# Altium schematic sheet BMP581.SchDoc
size A4; SheetNumber: 11; SheetTotal: 17
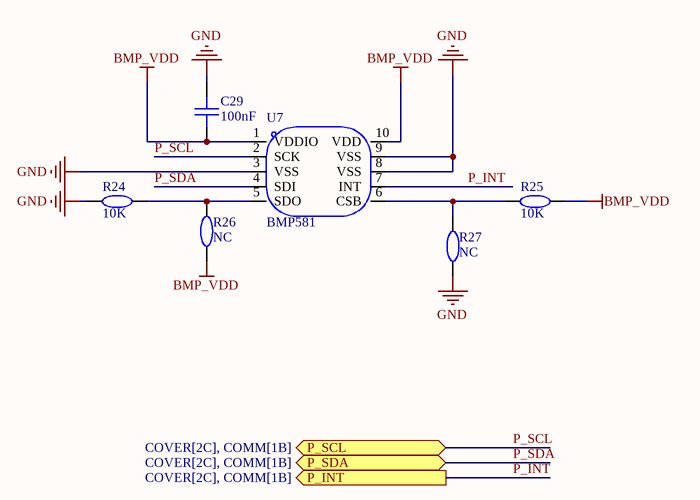
[diagram p0: BMP581.SchDoc]

## Parts
C29  100nF  [C0402]
R24  10K  [R0402]
R25  10K  [R0402]
R26  NC  [R0402]
R27  NC  [R0402]
U7  BMP581  [LGA-10_L2.0-W2.0-P0.50-TL_BMP581]

## Ports
P_INT (out, see COVER[2C], COMM[1B]), P_SCL (bidir, see COVER[2C], COMM[1B]), P_SDA (bidir, see COVER[2C], COMM[1B])

## Nets
BMP_VDD: C29.1 R25.2 R26.1 U7.1(VDDIO) U7.10(VDD)
GND: C29.2 R24.1 R27.1 U7.3(VSS) U7.8(VSS) U7.9(VSS)
P_INT: U7.7(INT) ; port P_INT
P_SCL: U7.2(SCK) ; port P_SCL
P_SDA: U7.4(SDI) ; port P_SDA
NetR24_2: R24.2 R26.2 U7.5(SDO)
NetR25_1: R25.1 R27.2 U7.6(CSB)

## Library data of the parts
C29 = CAP_0402: Symbol: CapAcitance; Device: CAP_0603; Convert to PCB: yes; Add into BOM: yes; Supplier Footprint: 0603; Value: 100nF; Name: 100nF
R24-R27 = Res_0402: Symbol: 电阻; Device: Res_0603; Convert to PCB: yes; Add into BOM: yes; Supplier Footprint: 0603
  R24 R25: Value: 10K; Name: 10K
  R26 R27: Value: NC; Name: NC
U7 = BMP581: Manufacturer: Bosch(博世); Add into BOM: yes; Symbol: BMP581; Device: BMP581; LCSC Part Name: BMP581; Supplier Part: C5362283; Manufacturer Part: BMP581; Supplier Footprint: LGA-10(2x2); Datasheet: https://atta.szlcsc.com/upload/public/pdf/source/20230606/E1C2E9A0F840B280A91BB131B6D3944D.pdf; Supplier: LCSC; Convert to PCB: yes; Name: BMP581